# Altium schematic sheet RK3566_SARADC_GPIO.SchDoc
size A3; SheetNumber: 7; SheetTotal: 13
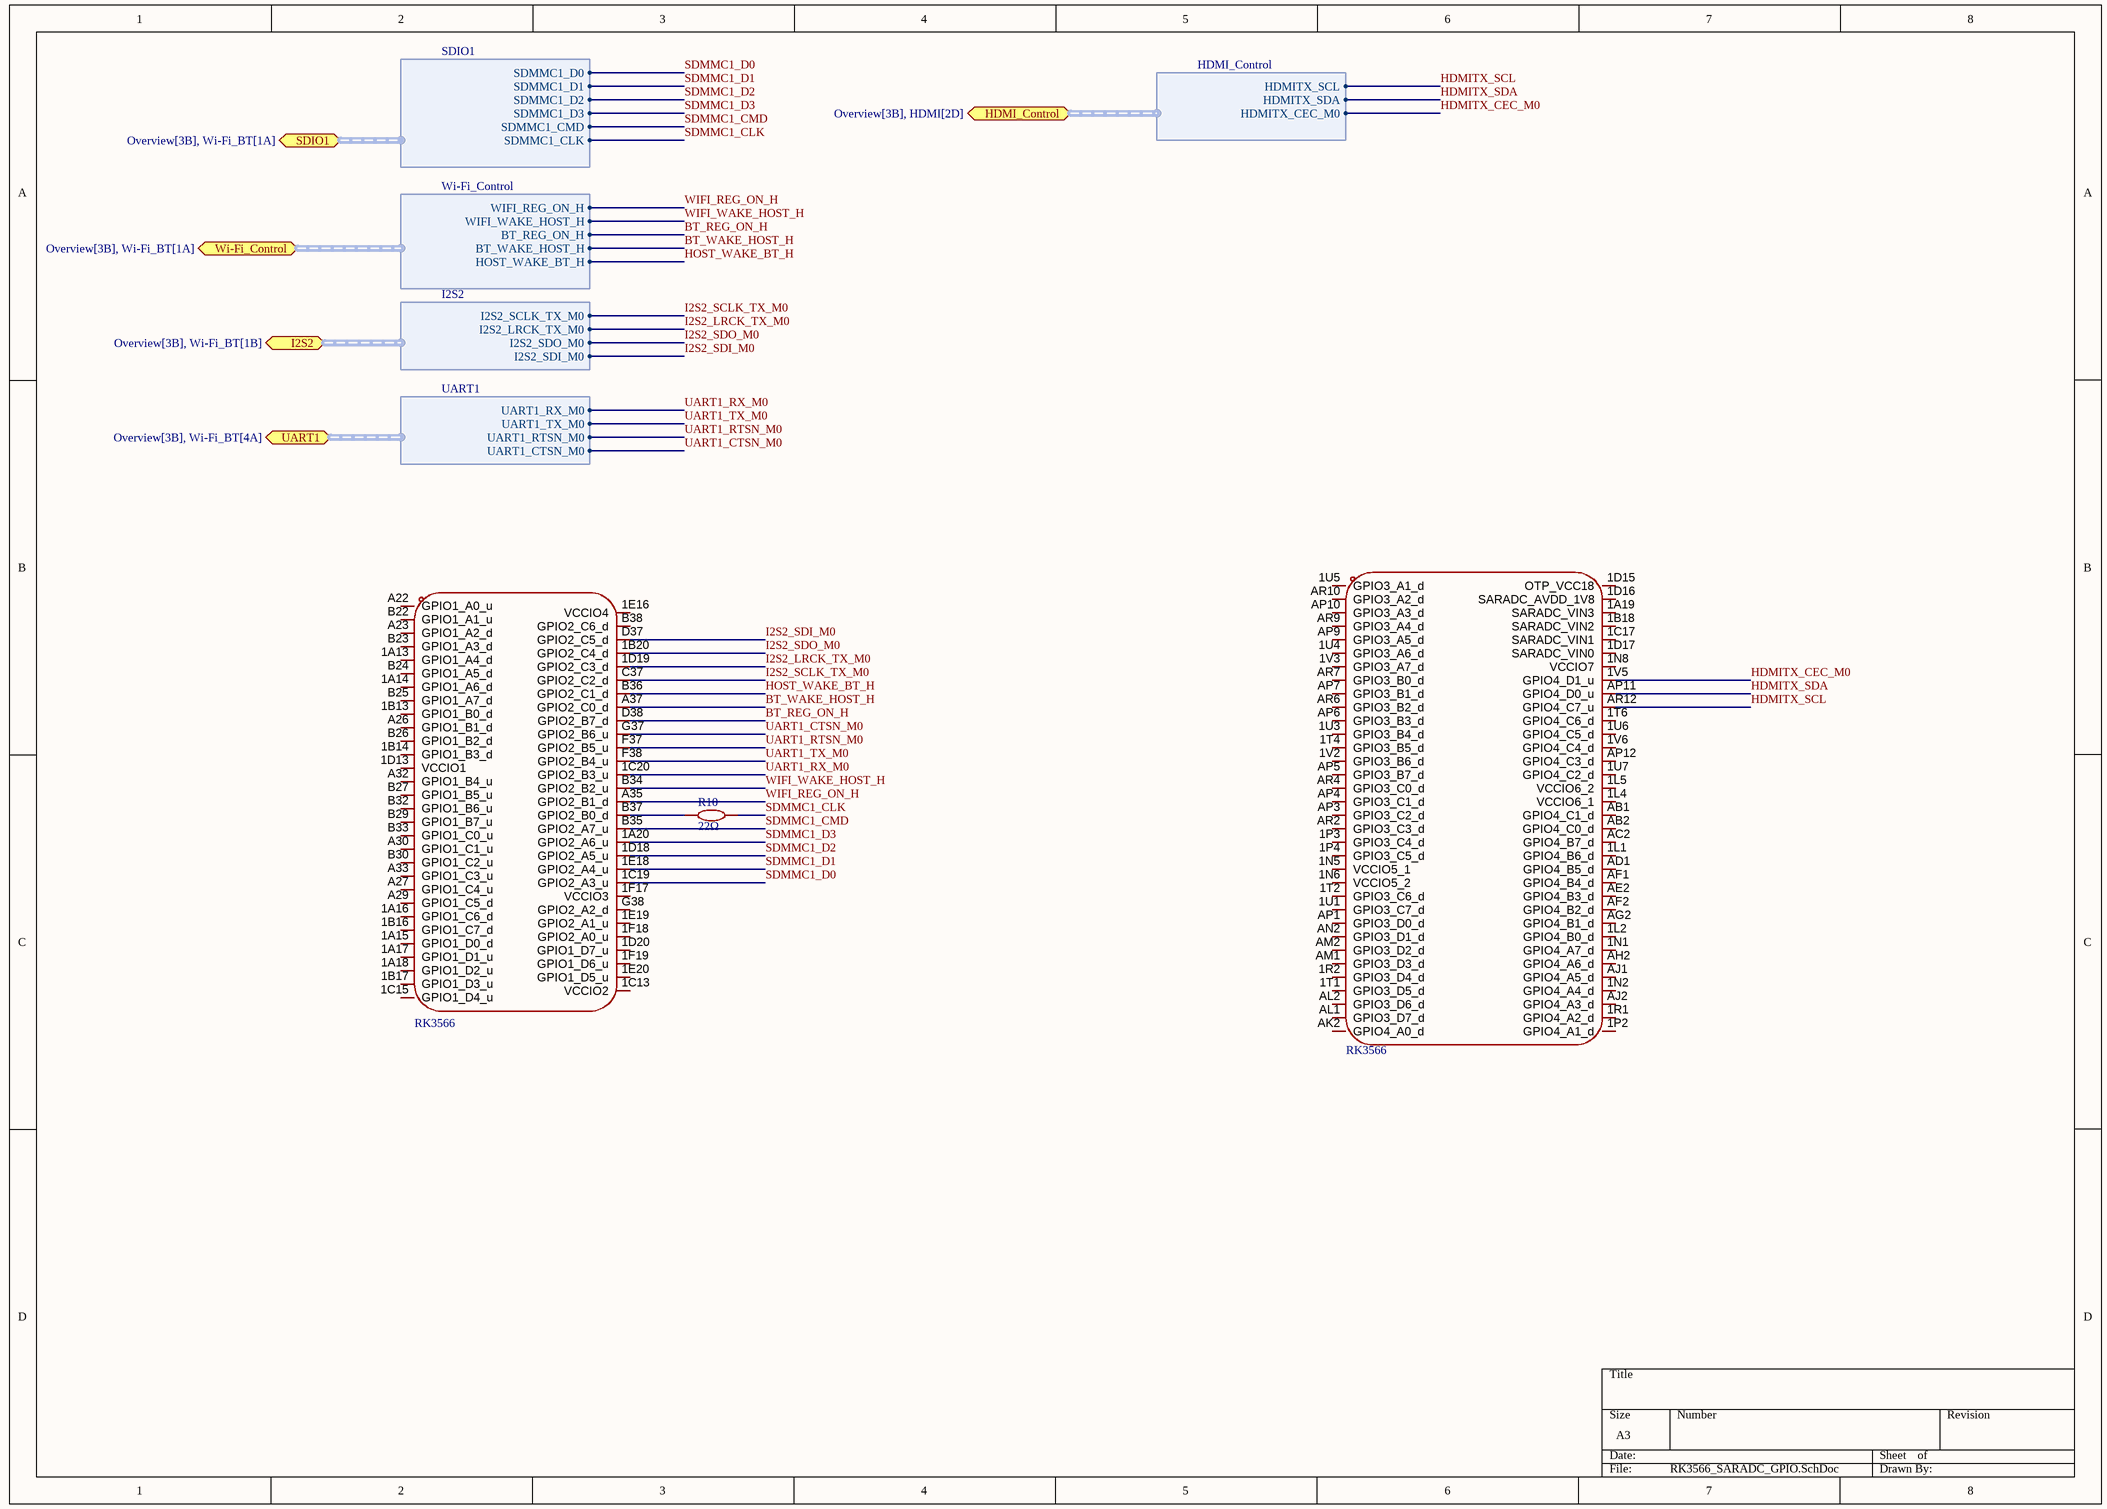
[diagram p0: RK3566_SARADC_GPIO.SchDoc]

## Parts
R10  22Ω  [R0402]
U1  RK3566  [BGA-565_L15.5-W14.4-P0.40_RK3566_1]  (parts E,F of 8)

## Ports
HDMI_Control (bidir, harness HDMI_Control, see Overview[3B], HDMI[2D]), I2S2 (bidir, harness I2S2, see Overview[3B], Wi-Fi_BT[1B]), SDIO1 (bidir, harness SDIO1, see Overview[3B], Wi-Fi_BT[1A]), UART1 (bidir, harness UARt1, see Overview[3B], Wi-Fi_BT[4A]), Wi-Fi_Control (bidir, harness Wi-Fi_Control, see Overview[3B], Wi-Fi_BT[1A])

## Harnesses
SDIO1: SDMMC1_D0, SDMMC1_D1, SDMMC1_D2, SDMMC1_D3, SDMMC1_CMD, SDMMC1_CLK
Wi-Fi_Control: WIFI_REG_ON_H, WIFI_WAKE_HOST_H, BT_REG_ON_H, BT_WAKE_HOST_H, HOST_WAKE_BT_H
I2S2: I2S2_SCLK_TX_M0, I2S2_LRCK_TX_M0, I2S2_SDO_M0, I2S2_SDI_M0
UART1: UART1_RX_M0, UART1_TX_M0, UART1_RTSN_M0, UART1_CTSN_M0
HDMI_Control: HDMITX_SCL, HDMITX_SDA, HDMITX_CEC_M0

## Nets
BT_REG_ON_H: U1.D38(GPIO2_B7_d) ; port Wi-Fi_Control.BT_REG_ON_H
BT_WAKE_HOST_H: U1.A37(GPIO2_C0_d) ; port Wi-Fi_Control.BT_WAKE_HOST_H
HDMITX_CEC_M0: U1.1V5(GPIO4_D1_u) ; port HDMI_Control.HDMITX_CEC_M0
HDMITX_SCL: U1.AR12(GPIO4_C7_u) ; port HDMI_Control.HDMITX_SCL
HDMITX_SDA: U1.AP11(GPIO4_D0_u) ; port HDMI_Control.HDMITX_SDA
HOST_WAKE_BT_H: U1.B36(GPIO2_C1_d) ; port Wi-Fi_Control.HOST_WAKE_BT_H
I2S2_LRCK_TX_M0: U1.1D19(GPIO2_C3_d) ; port I2S2.I2S2_LRCK_TX_M0
I2S2_SCLK_TX_M0: U1.C37(GPIO2_C2_d) ; port I2S2.I2S2_SCLK_TX_M0
I2S2_SDI_M0: U1.D37(GPIO2_C5_d) ; port I2S2.I2S2_SDI_M0
I2S2_SDO_M0: U1.1B20(GPIO2_C4_d) ; port I2S2.I2S2_SDO_M0
SDMMC1_CLK: R10.2 ; port SDIO1.SDMMC1_CLK
SDMMC1_CMD: U1.B35(GPIO2_A7_u) ; port SDIO1.SDMMC1_CMD
SDMMC1_D0: U1.1C19(GPIO2_A3_u) ; port SDIO1.SDMMC1_D0
SDMMC1_D1: U1.1E18(GPIO2_A4_u) ; port SDIO1.SDMMC1_D1
SDMMC1_D2: U1.1D18(GPIO2_A5_u) ; port SDIO1.SDMMC1_D2
SDMMC1_D3: U1.1A20(GPIO2_A6_u) ; port SDIO1.SDMMC1_D3
UART1_CTSN_M0: U1.G37(GPIO2_B6_u) ; port UART1.UART1_CTSN_M0
UART1_RTSN_M0: U1.F37(GPIO2_B5_u) ; port UART1.UART1_RTSN_M0
UART1_RX_M0: U1.1C20(GPIO2_B3_u) ; port UART1.UART1_RX_M0
UART1_TX_M0: U1.F38(GPIO2_B4_u) ; port UART1.UART1_TX_M0
WIFI_REG_ON_H: U1.A35(GPIO2_B1_d) ; port Wi-Fi_Control.WIFI_REG_ON_H
WIFI_WAKE_HOST_H: U1.B34(GPIO2_B2_u) ; port Wi-Fi_Control.WIFI_WAKE_HOST_H
NetR10_1: R10.1 U1.B37(GPIO2_B0_d)

Not connected (* = marked no-connect by the designer): U1 1A13(GPIO1_A4_d) 1A14(GPIO1_A6_d) 1A15(GPIO1_D0_d) 1A16(GPIO1_C6_d) 1A17(GPIO1_D1_u) 1A18(GPIO1_D2_u) 1A19(SARADC_VIN3) 1B13(GPIO1_B0_d) 1B14(GPIO1_B3_d) 1B16(GPIO1_C7_d) 1B17(GPIO1_D3_u) 1B18(SARADC_VIN2) 1C13(VCCIO2) 1C15(GPIO1_D4_u) 1C17(SARADC_VIN1) 1D13(VCCIO1) 1D15(OTP_VCC18) 1D16(SARADC_AVDD_1V8) 1D17(SARADC_VIN0) 1D20(GPIO1_D7_u) 1E16(VCCIO4) 1E19(GPIO2_A1_u) 1E20(GPIO1_D5_u) 1F17(VCCIO3) 1F18(GPIO2_A0_u) 1F19(GPIO1_D6_u) 1L1(GPIO4_B6_d) 1L2(GPIO4_B0_d) 1L4(VCCIO6_1) 1L5(VCCIO6_2) 1N1(GPIO4_A7_d) 1N2(GPIO4_A4_d) 1N5(VCCIO5_1) 1N6(VCCIO5_2) 1N8(VCCIO7) 1P2(GPIO4_A1_d) 1P3(GPIO3_C4_d) 1P4(GPIO3_C5_d) 1R1(GPIO4_A2_d) 1R2(GPIO3_D4_d) 1T1(GPIO3_D5_d) 1T2(GPIO3_C6_d) 1T4(GPIO3_B5_d) 1T6(GPIO4_C6_d) 1U1(GPIO3_C7_d) 1U3(GPIO3_B4_d) 1U4(GPIO3_A6_d) 1U5(GPIO3_A1_d) 1U6(GPIO4_C5_d) 1U7(GPIO4_C2_d) 1V2(GPIO3_B6_d) 1V3(GPIO3_A7_d) 1V6(GPIO4_C4_d) A22(GPIO1_A0_u) A23(GPIO1_A2_d) A26(GPIO1_B1_d) A27(GPIO1_C4_u) A29(GPIO1_C5_d) A30(GPIO1_C1_u) A32(GPIO1_B4_u) A33(GPIO1_C3_u) AB1(GPIO4_C1_d) AB2(GPIO4_C0_d) AC2(GPIO4_B7_d) AD1(GPIO4_B5_d) AE2(GPIO4_B3_d) AF1(GPIO4_B4_d) AF2(GPIO4_B2_d) AG2(GPIO4_B1_d) AH2(GPIO4_A6_d) AJ1(GPIO4_A5_d) AJ2(GPIO4_A3_d) AK2(GPIO4_A0_d) AL1(GPIO3_D7_d) AL2(GPIO3_D6_d) AM1(GPIO3_D3_d) AM2(GPIO3_D2_d) AN2(GPIO3_D1_d) AP1(GPIO3_D0_d) AP3(GPIO3_C2_d) AP4(GPIO3_C1_d) AP5(GPIO3_B7_d) AP6(GPIO3_B3_d) AP7(GPIO3_B1_d) AP9(GPIO3_A5_d) AP10(GPIO3_A3_d) AP12(GPIO4_C3_d) AR2(GPIO3_C3_d) AR4(GPIO3_C0_d) AR6(GPIO3_B2_d) AR7(GPIO3_B0_d) AR9(GPIO3_A4_d) AR10(GPIO3_A2_d) B22(GPIO1_A1_u) B23(GPIO1_A3_d) B24(GPIO1_A5_d) B25(GPIO1_A7_d) B26(GPIO1_B2_d) B27(GPIO1_B5_u) B29(GPIO1_B7_u) B30(GPIO1_C2_u) B32(GPIO1_B6_u) B33(GPIO1_C0_u) B38(GPIO2_C6_d) G38(GPIO2_A2_d)

## Library data of the parts
R10 = 22Ω: 62.5mW 33Ω 50V ±100ppm/℃ Thick Film Resistor ±1% 0402 Chip Resistor - Surface Mount ROHS
U1 = RK3566: BGA-565(15.5x14.4); Symbol: RK3566